# EasyEDA schematic schematics.json
TITLE: USB Power Out; REV: 1.0; Date: 2024-08-07; Sheet: 1/1; Drawn By: Arthur LAURENT; Company: Mental Noise
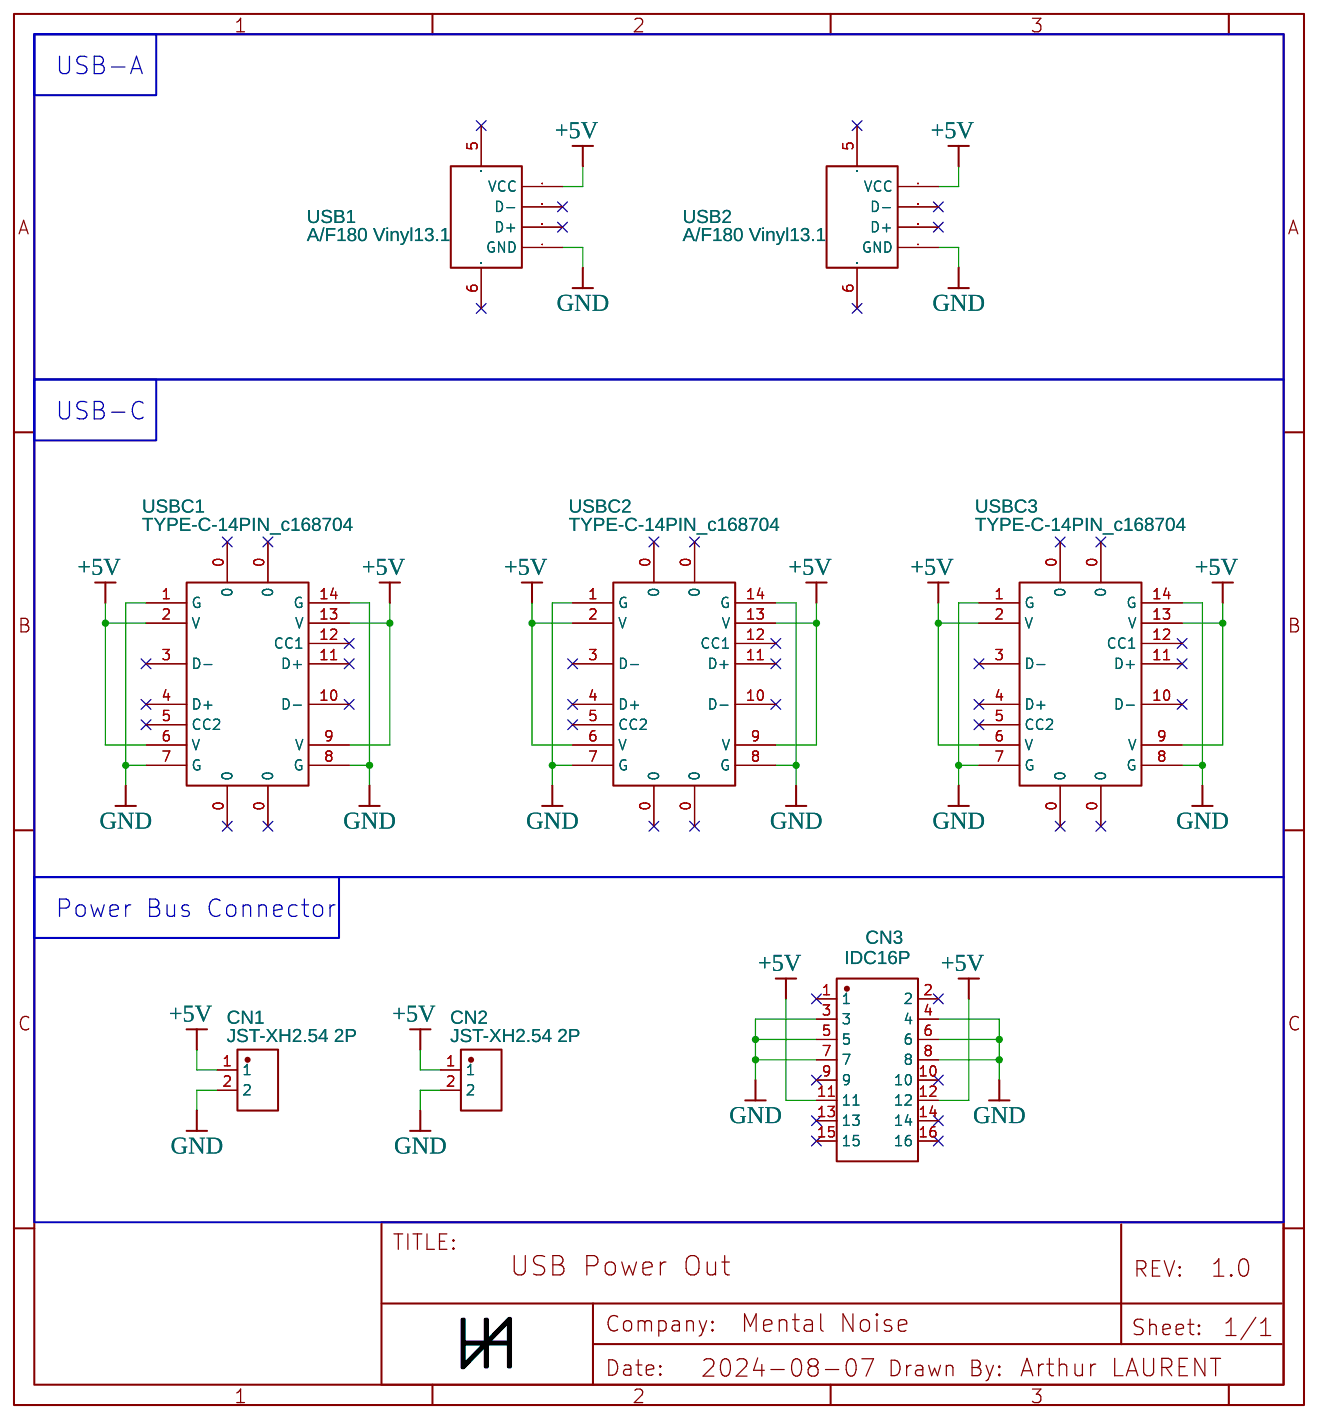
[diagram p0: schematic sheet]

## Parts
CN1  JST-XH2.54 2P  [JST-XH2.54 2P]
CN2  JST-XH2.54 2P  [JST-XH2.54 2P]
CN3  IDC16P  [HDR-TH_16P-P2.54-V-M-R2-C8-S2.54-5]
USB1  A/F180 Vinyl13.1  [USB-A-TH_USB-M-18]
USB2  A/F180 Vinyl13.1  [USB-A-TH_USB-M-18]
USBC1  TYPE-C-14PIN_c168704  [USB-C-TH_TYPE-C-USB-14P]
USBC2  TYPE-C-14PIN_c168704  [USB-C-TH_TYPE-C-USB-14P]
USBC3  TYPE-C-14PIN_c168704  [USB-C-TH_TYPE-C-USB-14P]

## Library data of the parts
CN1 CN2 = JST-XH2.54 2P: Supplier: CQRobot; link: https://www.amazon.fr/dp/B01EQGNZ2I/?coliid=IQPWZUUK7M1P0&colid=2CFFEVMK4YZ12&ref_=lv_ov_lig_dp_it_im&th=1; Contributor: marierigal4
CN3 = MZ254R-22-16-10: Supplier: LCSC; Supplier Part: C19191975; Manufacturer: DEALON(德艺隆); Contributor: lcsc
USB1 USB2 = A/F180 Vinyl13.1: Supplier: LCSC; Manufacturer: 精拓金; Manufacturer Part: 916-151A1022Y10200; Supplier Part: C46411; JLCPCB Part Class: Extended Part
USBC1-USBC3 = TYPE-C-14PIN_c168704: Supplier: LCSC; Supplier Part: C168704; Manufacturer: LCSC; Contributor: TR_PCB; JLCPCB Part Class: Extended Part

## Nets
+5V: CN1.1 CN2.1 CN3.11 CN3.12 USB1.1(VCC) USB2.1(VCC) USBC1.2(V) USBC1.6(V) USBC1.9(V) USBC1.13(V) USBC2.2(V) USBC2.6(V) USBC2.9(V) USBC2.13(V) USBC3.2(V) USBC3.6(V) USBC3.9(V) USBC3.13(V)
GND: CN1.2 CN2.2 CN3.3 CN3.4 CN3.5 CN3.6 CN3.7 CN3.8 USB1.4(GND) USB2.4(GND) USBC1.1(G) USBC1.7(G) USBC1.8(G) USBC1.14(G) USBC2.1(G) USBC2.7(G) USBC2.8(G) USBC2.14(G) USBC3.1(G) USBC3.7(G) USBC3.8(G) USBC3.14(G)

Not connected (* = marked no-connect by the designer): CN3 1* 2* 9* 10* 13* 14* 15* 16*; USB1 2(D-)* 3(D+)* 5* 6*; USB2 2(D-)* 3(D+)* 5* 6*; USBC1 0* 3(D-)* 4(D+)* 5(CC2)* 10(D-)* 11(D+)* 12(CC1)*; USBC2 0* 3(D-)* 4(D+)* 5(CC2)* 10(D-)* 11(D+)* 12(CC1)*; USBC3 0* 3(D-)* 4(D+)* 5(CC2)* 10(D-)* 11(D+)* 12(CC1)*

## Notes on the sheet
- USB-A
- USB-C
- Power Bus Connector
